# Altium schematic sheet Thermocouples.SchDoc
size A4
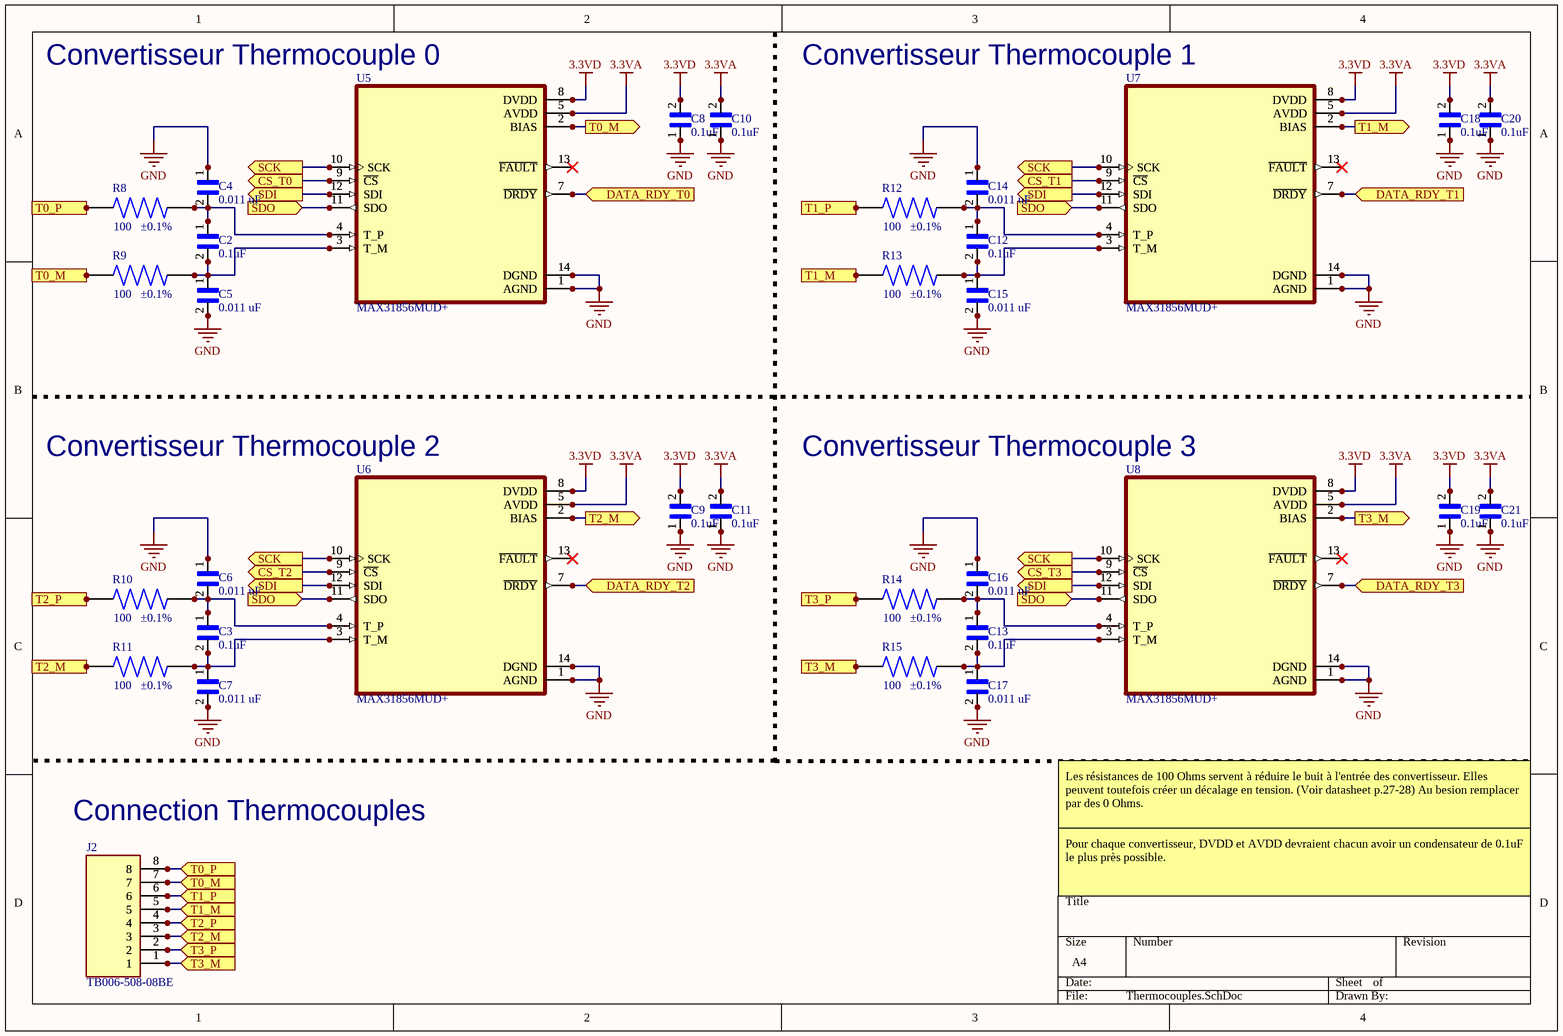
[diagram p0: Thermocouples.SchDoc]

## Parts
C2  value 0.1uF  [C3216C0G1H104J160AA]  (hidden comment: C3216C0G1H104J160AA)
C3  value 0.1uF  [C3216C0G1H104J160AA]  (hidden comment: C3216C0G1H104J160AA)
C4  value 0.011 uF  [GRM3195C1H113JA01D]  (hidden comment: GRM3195C1H113JA01D)
C5  value 0.011 uF  [GRM3195C1H113JA01D]  (hidden comment: GRM3195C1H113JA01D)
C6  value 0.011 uF  [GRM3195C1H113JA01D]  (hidden comment: GRM3195C1H113JA01D)
C7  value 0.011 uF  [GRM3195C1H113JA01D]  (hidden comment: GRM3195C1H113JA01D)
C8  value 0.1uF  [C3216C0G1H104J160AA]  (hidden comment: C3216C0G1H104J160AA)
C9  value 0.1uF  [C3216C0G1H104J160AA]  (hidden comment: C3216C0G1H104J160AA)
C10  value 0.1uF  [C3216C0G1H104J160AA]  (hidden comment: C3216C0G1H104J160AA)
C11  value 0.1uF  [C3216C0G1H104J160AA]  (hidden comment: C3216C0G1H104J160AA)
C12  value 0.1uF  [C3216C0G1H104J160AA]  (hidden comment: C3216C0G1H104J160AA)
C13  value 0.1uF  [C3216C0G1H104J160AA]  (hidden comment: C3216C0G1H104J160AA)
C14  value 0.011 uF  [GRM3195C1H113JA01D]  (hidden comment: GRM3195C1H113JA01D)
C15  value 0.011 uF  [GRM3195C1H113JA01D]  (hidden comment: GRM3195C1H113JA01D)
C16  value 0.011 uF  [GRM3195C1H113JA01D]  (hidden comment: GRM3195C1H113JA01D)
C17  value 0.011 uF  [GRM3195C1H113JA01D]  (hidden comment: GRM3195C1H113JA01D)
C18  value 0.1uF  [C3216C0G1H104J160AA]  (hidden comment: C3216C0G1H104J160AA)
C19  value 0.1uF  [C3216C0G1H104J160AA]  (hidden comment: C3216C0G1H104J160AA)
C20  value 0.1uF  [C3216C0G1H104J160AA]  (hidden comment: C3216C0G1H104J160AA)
C21  value 0.1uF  [C3216C0G1H104J160AA]  (hidden comment: C3216C0G1H104J160AA)
J2  TB006-508-08BE  [TB006-508-08BE]
R8  value 100  Tolerance: ±0.1%  [RNCS1206BKE100R]  (hidden comment: RNCS1206BKE100R)
R9  value 100  Tolerance: ±0.1%  [RNCS1206BKE100R]  (hidden comment: RNCS1206BKE100R)
R10  value 100  Tolerance: ±0.1%  [RNCS1206BKE100R]  (hidden comment: RNCS1206BKE100R)
R11  value 100  Tolerance: ±0.1%  [RNCS1206BKE100R]  (hidden comment: RNCS1206BKE100R)
R12  value 100  Tolerance: ±0.1%  [RNCS1206BKE100R]  (hidden comment: RNCS1206BKE100R)
R13  value 100  Tolerance: ±0.1%  [RNCS1206BKE100R]  (hidden comment: RNCS1206BKE100R)
R14  value 100  Tolerance: ±0.1%  [RNCS1206BKE100R]  (hidden comment: RNCS1206BKE100R)
R15  value 100  Tolerance: ±0.1%  [RNCS1206BKE100R]  (hidden comment: RNCS1206BKE100R)
U5  MAX31856MUD+  [PCBComponent_1]
U6  MAX31856MUD+  [PCBComponent_1]
U7  MAX31856MUD+  [PCBComponent_1]
U8  MAX31856MUD+  [PCBComponent_1]

## Ports
CS_T0 (out), CS_T1 (out), CS_T2 (out), CS_T3 (out), DATA_RDY_T0 (in), DATA_RDY_T1 (in), DATA_RDY_T2 (in), DATA_RDY_T3 (in), SCK (out), SDI (out), SDO (in), T0_M (in), T0_M (out), T0_P (in), T0_P (out), T1_M (in), T1_M (out), T1_P (in), T1_P (out), T2_M (in), T2_M (out), T2_P (in), T2_P (out), T3_M (in), T3_M (out), T3_P (in), T3_P (out)

## Nets
3.3VA: C10.2 C11.2 C20.2 C21.2 U5.5(AVDD) U6.5(AVDD) U7.5(AVDD) U8.5(AVDD)
3.3VD: C8.2 C9.2 C18.2 C19.2 U5.8(DVDD) U6.8(DVDD) U7.8(DVDD) U8.8(DVDD)
GND: C4.1 C5.2 C6.1 C7.2 C8.1 C9.1 C10.1 C11.1 C14.1 C15.2 C16.1 C17.2 C18.1 C19.1 C20.1 C21.1 U5.1(AGND) U5.14(DGND) U6.1(AGND) U6.14(DGND) U7.1(AGND) U7.14(DGND) U8.1(AGND) U8.14(DGND)
CS_T0: U5.9(~{CS}) ; port CS_T0
CS_T1: U7.9(~{CS}) ; port CS_T1
CS_T2: U6.9(~{CS}) ; port CS_T2
CS_T3: U8.9(~{CS}) ; port CS_T3
DATA_RDY_T0: U5.7(~{DRDY}) ; port DATA_RDY_T0
DATA_RDY_T1: U7.7(~{DRDY}) ; port DATA_RDY_T1
DATA_RDY_T2: U6.7(~{DRDY}) ; port DATA_RDY_T2
DATA_RDY_T3: U8.7(~{DRDY}) ; port DATA_RDY_T3
SCK: U5.10(SCK) U6.10(SCK) U7.10(SCK) U8.10(SCK) ; port SCK
SDI: U5.12(SDI) U6.12(SDI) U7.12(SDI) U8.12(SDI) ; port SDI
SDO: U5.11(SDO) U6.11(SDO) U7.11(SDO) U8.11(SDO) ; port SDO
T0_M: J2.7 R9.1 U5.2(BIAS) ; port T0_M
T0_P: J2.8 R8.1 ; port T0_P
T1_M: J2.5 R13.1 U7.2(BIAS) ; port T1_M
T1_P: J2.6 R12.1 ; port T1_P
T2_M: J2.3 R11.1 U6.2(BIAS) ; port T2_M
T2_P: J2.4 R10.1 ; port T2_P
T3_M: J2.1 R15.1 U8.2(BIAS) ; port T3_M
T3_P: J2.2 R14.1 ; port T3_P
NetC2_1: C2.1 C4.2 R8.2 U5.4(T_P)
NetC2_2: C2.2 C5.1 R9.2 U5.3(T_M)
NetC3_1: C3.1 C6.2 R10.2 U6.4(T_P)
NetC3_2: C3.2 C7.1 R11.2 U6.3(T_M)
NetC12_1: C12.1 C14.2 R12.2 U7.4(T_P)
NetC12_2: C12.2 C15.1 R13.2 U7.3(T_M)
NetC13_1: C13.1 C16.2 R14.2 U8.4(T_P)
NetC13_2: C13.2 C17.1 R15.2 U8.3(T_M)

Not connected (* = marked no-connect by the designer): U5 13(~{FAULT})*; U6 13(~{FAULT})*; U7 13(~{FAULT})*; U8 13(~{FAULT})*

## Notes on the sheet
- (near U5) Convertisseur Thermocouple 0
- (near U7) Convertisseur Thermocouple 1
- (near U6) Convertisseur Thermocouple 2
- (near U8) Convertisseur Thermocouple 3
- (near J2) Connection Thermocouples
- Les résistances de 100 Ohms servent à réduire le buit à l'entrée des convertisseur. Elles peuvent toutefois créer un décalage en tension. (Voir datasheet p.27-28) Au besion remplacer par des 0 Ohms.
- Pour chaque convertisseur, DVDD et AVDD devraient chacun avoir un condensateur de 0.1uF le plus près possible.

## Library data of the parts
R8-R15 = RNCS1206BKE100R: Res Thin Film 1206 100 Ohm 0.1% 0.125W(1/8W); Supplier 1: Digi-Key; Supplier Part Number 1: RNCS1206BKE100RCT-ND